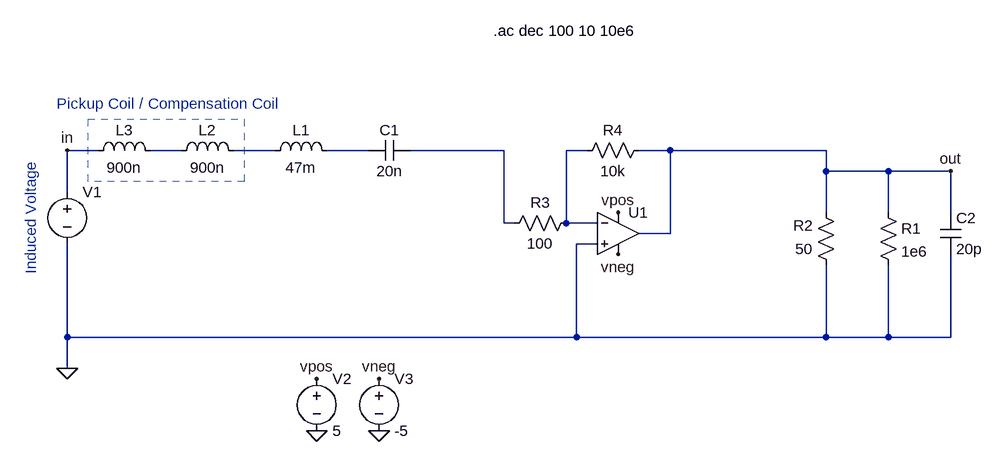
[diagram p0: schematic initial_bandpass.asc]
initial_bandpass.asc, the LTspice schematic file:
Version 4
SHEET 1 880 680
WIRE -848 112 -896 112
WIRE -720 112 -768 112
WIRE -576 112 -640 112
WIRE -432 112 -496 112
WIRE -224 112 -368 112
WIRE -96 112 -128 112
WIRE 32 112 -16 112
WIRE 272 112 32 112
WIRE 272 144 272 112
WIRE 368 144 272 144
WIRE 464 144 368 144
WIRE -896 176 -896 112
WIRE 272 208 272 144
WIRE 368 208 368 144
WIRE 464 208 464 144
WIRE -224 224 -224 112
WIRE -208 224 -224 224
WIRE -128 224 -128 112
WIRE -80 224 -128 224
WIRE 32 240 32 112
WIRE 32 240 -16 240
WIRE -80 256 -112 256
WIRE -896 400 -896 256
WIRE -112 400 -112 256
WIRE -112 400 -896 400
WIRE 272 400 272 288
WIRE 272 400 -112 400
WIRE 368 400 368 288
WIRE 368 400 272 400
WIRE 464 400 464 272
WIRE 464 400 368 400
WIRE -896 448 -896 400
FLAG -512 544 0
FLAG -416 544 0
FLAG -512 464 vpos
FLAG -416 464 vneg
FLAG -48 272 vneg
FLAG -48 208 vpos
FLAG 464 144 out
FLAG -896 112 in
FLAG -896 448 0
SYMBOL voltage -896 160 R0
WINDOW 39 0 0 Left 0
SYMATTR InstName V1
SYMATTR Value ""
SYMATTR Value2 AC 1 0
SYMBOL cap -368 96 R90
WINDOW 0 0 32 VBottom 2
WINDOW 3 32 32 VTop 2
SYMATTR InstName C1
SYMATTR Value 20n
SYMBOL res 352 192 R0
SYMATTR InstName R1
SYMATTR Value 1e6
SYMBOL cap 448 208 R0
SYMATTR InstName C2
SYMATTR Value 20p
SYMBOL res 288 304 R180
WINDOW 0 36 76 Left 2
WINDOW 3 36 40 Left 2
SYMATTR InstName R2
SYMATTR Value 50
SYMBOL res -112 208 R90
WINDOW 0 0 56 VBottom 2
WINDOW 3 32 56 VTop 2
SYMATTR InstName R3
SYMATTR Value 100
SYMBOL res 0 96 R90
WINDOW 0 0 56 VBottom 2
WINDOW 3 32 56 VTop 2
SYMATTR InstName R4
SYMATTR Value 10k
SYMBOL voltage -512 448 R0
WINDOW 123 0 0 Left 0
WINDOW 39 0 0 Left 0
SYMATTR InstName V2
SYMATTR Value 5
SYMBOL voltage -416 448 R0
WINDOW 123 0 0 Left 0
WINDOW 39 0 0 Left 0
SYMATTR InstName V3
SYMATTR Value -5
SYMBOL Opamps\\UniversalOpamp2 -48 240 R0
SYMATTR InstName U1
SYMBOL ind -592 128 R270
WINDOW 0 32 56 VTop 2
WINDOW 3 5 56 VBottom 2
SYMATTR InstName L1
SYMATTR Value 47m
SYMATTR SpiceLine Rser=8.3
SYMBOL ind -736 128 R270
WINDOW 0 32 56 VTop 2
WINDOW 3 5 56 VBottom 2
SYMATTR InstName L2
SYMATTR Value 900n
SYMATTR SpiceLine Rser=0.3
SYMBOL ind -864 128 R270
WINDOW 0 32 56 VTop 2
WINDOW 3 5 56 VBottom 2
SYMATTR InstName L3
SYMATTR Value 900n
SYMATTR SpiceLine Rpar=0.3
TEXT -240 -72 Left 2 !.ac dec 100 10 10e6
TEXT -912 40 Left 2 ;Pickup Coil / Compensation Coil
TEXT -952 128 VRight 2 ;Induced Voltage
RECTANGLE Normal -624 160 -864 64 2

The netlist it stands for:
* initial_bandpass.asc
V1 in 0 AC 1 0
C1 N004 N003 20n
R1 out 0 1e6
C2 out 0 20p
R2 0 out 50
R3 N005 N004 100
R4 out N005 10k
V2 vpos 0 5
V3 vneg 0 -5
XU1 0 N005 vpos vneg out level.2 Avol=1Meg GBW=10Meg Slew=10Meg ilimit=25m rail=0 Vos=0 phimargin=45 en=0 enk=0 in=0 ink=0 Rin=500Meg  ; pins IN+ IN- V+ V- OUT
L1 N002 N003 47m Rser=8.3
L2 N001 N002 900n Rser=0.3
L3 in N001 900n Rpar=0.3
.ac dec 100 10 10e6
* Pickup Coil / Compensation Coil
* Induced Voltage
.lib UniversalOpamps2.sub
.backanno
.end